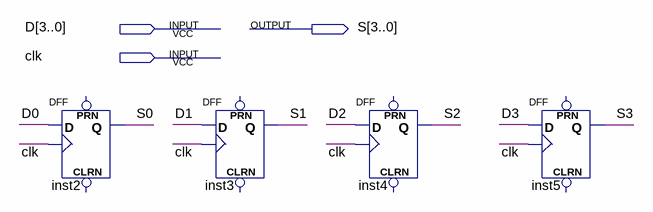
[diagram p0: schematic sheet]
// Quartus schematic DFF4.bdf as structural Verilog: 4 symbols, 3 pins
module DFF4 (
  input  [3:0] D,
  input  clk,
  output [3:0] S
);

  DFF inst2 (.CLK(clk), .D(D[0]), .Q(S[0]));  // open: CLRN, PRN
  DFF inst3 (.CLK(clk), .D(D[1]), .Q(S[1]));  // open: CLRN, PRN
  DFF inst4 (.CLK(clk), .D(D[2]), .Q(S[2]));  // open: CLRN, PRN
  DFF inst5 (.CLK(clk), .D(D[3]), .Q(S[3]));  // open: CLRN, PRN
endmodule
